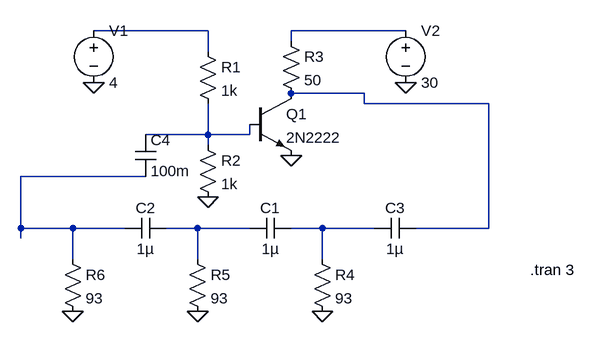
[diagram p0: schematic RC.asc]
RC.asc, the LTspice schematic file:
Version 4
SHEET 1 3464 680
WIRE 112 -96 -64 -96
WIRE 416 -96 240 -96
WIRE 240 -80 240 -96
WIRE 112 -64 112 -96
WIRE 352 0 240 0
WIRE 352 16 352 0
WIRE 544 16 352 16
WIRE 112 64 112 16
WIRE 112 64 16 64
WIRE 176 64 176 48
WIRE 176 64 112 64
WIRE 112 80 112 64
WIRE 16 128 -176 128
WIRE -176 208 -176 128
WIRE -96 208 -176 208
WIRE -16 208 -96 208
WIRE 96 208 48 208
WIRE 176 208 96 208
WIRE 288 208 240 208
WIRE 368 208 288 208
WIRE 544 208 544 16
WIRE 544 208 432 208
WIRE -176 224 -176 208
WIRE -96 256 -96 208
WIRE 96 256 96 208
WIRE 288 256 288 208
FLAG 240 96 0
FLAG 112 160 0
FLAG 416 -16 0
FLAG -64 -16 0
FLAG 288 336 0
FLAG 96 336 0
FLAG -96 336 0
SYMBOL npn 176 0 R0
SYMATTR InstName Q1
SYMATTR Value 2N2222
SYMBOL res 96 -80 R0
SYMATTR InstName R1
SYMATTR Value 1k
SYMBOL res 96 64 R0
SYMATTR InstName R2
SYMATTR Value 1k
SYMBOL voltage 416 -112 R0
WINDOW 123 0 0 Left 0
WINDOW 39 0 0 Left 0
SYMATTR InstName V2
SYMATTR Value 30
SYMBOL cap 0 64 R0
SYMATTR InstName C4
SYMATTR Value 100m
SYMBOL res 224 -96 R0
SYMATTR InstName R3
SYMATTR Value 50
SYMBOL voltage -64 -112 R0
WINDOW 123 0 0 Left 0
WINDOW 39 0 0 Left 0
SYMATTR InstName V1
SYMATTR Value 4
SYMBOL cap 432 192 R90
WINDOW 0 0 32 VBottom 2
WINDOW 3 32 32 VTop 2
SYMATTR InstName C3
SYMATTR Value 1µ
SYMBOL res 272 240 R0
SYMATTR InstName R4
SYMATTR Value 93
SYMBOL cap 240 192 R90
WINDOW 0 0 32 VBottom 2
WINDOW 3 32 32 VTop 2
SYMATTR InstName C1
SYMATTR Value 1µ
SYMBOL res 80 240 R0
SYMATTR InstName R5
SYMATTR Value 93
SYMBOL cap 48 192 R90
WINDOW 0 0 32 VBottom 2
WINDOW 3 32 32 VTop 2
SYMATTR InstName C2
SYMATTR Value 1µ
SYMBOL res -112 240 R0
SYMATTR InstName R6
SYMATTR Value 93
TEXT 608 272 Left 2 !.tran 3

The netlist it stands for:
* RC.asc
Q1 N003 N004 0 0 2N2222
R1 N001 N004 1k
R2 N004 0 1k
V2 N002 0 30
C4 N004 N005 100m
R3 N002 N003 50
V1 N001 0 4
C3 N003 N007 1µ
R4 N007 0 93
C1 N007 N006 1µ
R5 N006 0 93
C2 N006 N005 1µ
R6 N005 0 93
.model NPN NPN
.model PNP PNP
.lib standard.bjt
.tran 3
.backanno
.end